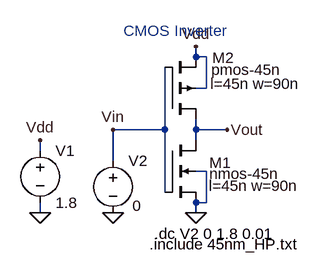
[diagram p0: schematic CMOS Inverter.asc]
CMOS Inverter.asc, the LTspice schematic file:
Version 4
SHEET 1 880 680
WIRE 112 -32 112 -48
WIRE 128 -32 112 -32
WIRE 128 16 128 -32
WIRE 128 16 112 16
WIRE 64 80 64 -16
WIRE 64 80 -16 80
WIRE 112 80 112 64
WIRE 160 80 112 80
WIRE 112 96 112 80
WIRE -128 112 -128 96
WIRE -16 128 -16 80
WIRE 128 144 112 144
WIRE 64 176 64 80
WIRE 128 192 128 144
WIRE 128 192 112 192
WIRE -128 208 -128 192
WIRE 112 208 112 192
FLAG -16 208 0
FLAG 112 208 0
FLAG -128 208 0
FLAG -128 96 Vdd
FLAG 112 -48 Vdd
FLAG -16 80 Vin
FLAG 160 80 Vout
SYMBOL nmos4 64 96 R0
WINDOW 3 69 52 Left 2
WINDOW 123 68 70 Left 2
WINDOW 0 69 35 Left 2
SYMATTR Value nmos-45n
SYMATTR Value2 l=45n w=90n
SYMATTR InstName M1
SYMBOL voltage -128 96 R0
WINDOW 123 0 0 Left 2
WINDOW 39 0 0 Left 2
SYMATTR InstName V1
SYMATTR Value 1.8
SYMBOL voltage -16 112 R0
WINDOW 123 0 0 Left 2
WINDOW 39 0 0 Left 2
WINDOW 3 30 85 Left 2
SYMATTR Value 0
SYMATTR InstName V2
SYMBOL pmos4 64 64 M180
WINDOW 0 73 95 Left 2
WINDOW 3 72 76 Left 2
WINDOW 123 70 55 Left 2
SYMATTR InstName M2
SYMATTR Value pmos-45n
SYMATTR Value2 l=45n w=90n
TEXT 40 256 Left 2 !.include 45nm_HP.txt
TEXT 48 240 Left 2 !.dc V2 0 1.8 0.01
TEXT 0 -72 Left 2 ;CMOS Inverter

The netlist it stands for:
* CMOS Inverter.asc
M1 Vout Vin 0 0 nmos-45n l=45n w=90n
V1 Vdd 0 1.8
V2 Vin 0 0
M2 Vout Vin Vdd Vdd pmos-45n l=45n w=90n
.model NMOS NMOS
.model PMOS PMOS
.lib standard.mos
.include 45nm_HP.txt
.dc V2 0 1.8 0.01
* CMOS Inverter
.backanno
.end